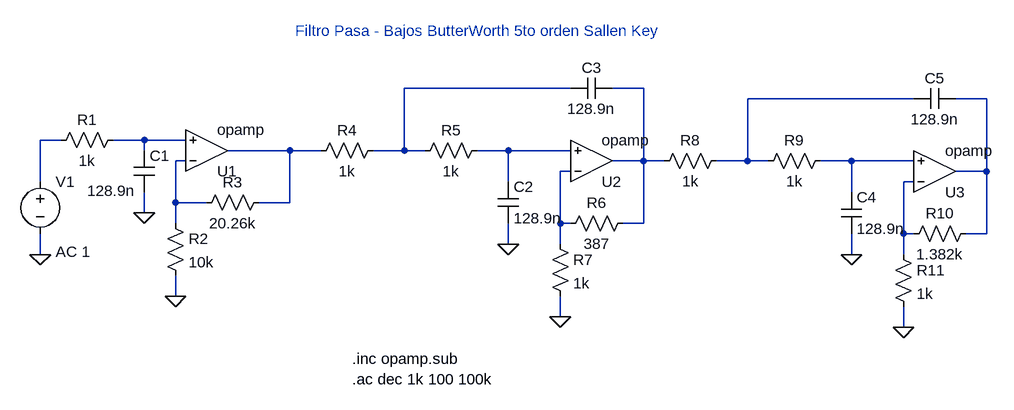
[diagram p0: schematic EJE2.asc]
EJE2.asc, the LTspice schematic file:
Version 4
SHEET 1 1384 680
WIRE 736 16 480 16
WIRE 848 16 800 16
WIRE 1264 32 1008 32
WIRE 1376 32 1328 32
WIRE -48 96 -80 96
WIRE 80 96 32 96
WIRE 144 96 80 96
WIRE 80 112 80 96
WIRE 304 112 208 112
WIRE 352 112 304 112
WIRE 480 112 480 16
WIRE 480 112 432 112
WIRE 512 112 480 112
WIRE 640 112 592 112
WIRE 736 112 640 112
WIRE 144 128 128 128
WIRE 848 128 848 16
WIRE 848 128 800 128
WIRE 880 128 848 128
WIRE 1008 128 1008 32
WIRE 1008 128 960 128
WIRE 1040 128 1008 128
WIRE 1168 128 1120 128
WIRE 1264 128 1168 128
WIRE 736 144 720 144
WIRE 1376 144 1376 32
WIRE 1376 144 1328 144
WIRE -80 160 -80 96
WIRE 640 160 640 112
WIRE 1264 160 1248 160
WIRE 1168 176 1168 128
WIRE 128 192 128 128
WIRE 176 192 128 192
WIRE 304 192 304 112
WIRE 304 192 256 192
WIRE 80 208 80 176
WIRE 128 224 128 192
WIRE 720 224 720 144
WIRE 736 224 720 224
WIRE 848 224 848 128
WIRE 848 224 816 224
WIRE 1248 240 1248 160
WIRE 1264 240 1248 240
WIRE 1376 240 1376 144
WIRE 1376 240 1344 240
WIRE 640 256 640 224
WIRE 720 256 720 224
WIRE -80 272 -80 240
WIRE 1168 272 1168 240
WIRE 1248 272 1248 240
WIRE 128 336 128 304
WIRE 720 368 720 336
WIRE 1248 384 1248 352
FLAG 128 336 0
FLAG 80 208 0
FLAG 640 256 0
FLAG 720 368 0
FLAG 1168 272 0
FLAG 1248 384 0
FLAG -80 272 0
SYMBOL res 48 80 R90
WINDOW 0 0 56 VBottom 2
WINDOW 3 32 56 VTop 2
SYMATTR InstName R1
SYMATTR Value 1k
SYMBOL cap 64 112 R0
WINDOW 3 -72 62 Left 2
SYMATTR Value 128.9n
SYMATTR InstName C1
SYMBOL OpAmps\\opamp 176 176 M180
SYMATTR InstName U1
SYMBOL res 112 208 R0
SYMATTR InstName R2
SYMATTR Value 10k
SYMBOL res 272 176 R90
WINDOW 0 0 56 VBottom 2
WINDOW 3 32 56 VTop 2
SYMATTR InstName R3
SYMATTR Value 20.26k
SYMBOL res 448 96 R90
WINDOW 0 0 56 VBottom 2
WINDOW 3 32 56 VTop 2
SYMATTR InstName R4
SYMATTR Value 1k
SYMBOL res 608 96 R90
WINDOW 0 0 56 VBottom 2
WINDOW 3 32 56 VTop 2
SYMATTR InstName R5
SYMATTR Value 1k
SYMBOL cap 624 160 R0
SYMATTR InstName C2
SYMATTR Value 128.9n
SYMBOL OpAmps\\opamp 768 192 M180
SYMATTR InstName U2
SYMBOL res 832 208 R90
WINDOW 0 0 56 VBottom 2
WINDOW 3 32 56 VTop 2
SYMATTR InstName R6
SYMATTR Value 387
SYMBOL res 704 240 R0
SYMATTR InstName R7
SYMATTR Value 1k
SYMBOL cap 800 0 R90
WINDOW 0 0 32 VBottom 2
WINDOW 3 32 32 VTop 2
SYMATTR InstName C3
SYMATTR Value 128.9n
SYMBOL res 976 112 R90
WINDOW 0 0 56 VBottom 2
WINDOW 3 32 56 VTop 2
SYMATTR InstName R8
SYMATTR Value 1k
SYMBOL res 1136 112 R90
WINDOW 0 0 56 VBottom 2
WINDOW 3 32 56 VTop 2
SYMATTR InstName R9
SYMATTR Value 1k
SYMBOL cap 1152 176 R0
SYMATTR InstName C4
SYMATTR Value 128.9n
SYMBOL OpAmps\\opamp 1296 208 M180
SYMATTR InstName U3
SYMBOL res 1360 224 R90
WINDOW 0 0 56 VBottom 2
WINDOW 3 32 56 VTop 2
SYMATTR InstName R10
SYMATTR Value 1.382k
SYMBOL res 1232 256 R0
SYMATTR InstName R11
SYMATTR Value 1k
SYMBOL cap 1328 16 R90
WINDOW 0 0 32 VBottom 2
WINDOW 3 32 32 VTop 2
SYMATTR InstName C5
SYMATTR Value 128.9n
SYMBOL voltage -80 144 R0
WINDOW 123 24 124 Left 2
WINDOW 39 0 0 Left 0
SYMATTR Value2 AC 1
SYMATTR InstName V1
SYMATTR Value ""
TEXT 400 464 Left 2 !.ac dec 1k 100 100k
TEXT 400 432 Left 2 !.inc opamp.sub
TEXT 312 -72 Left 2 ;Filtro Pasa - Bajos ButterWorth 5to orden Sallen Key

The netlist it stands for:
* EJE2.asc
R1 N006 N005 1k
C1 N006 0 128.9n
XU1 N009 N006 N007 opamp Aol=100K GBW=10Meg  ; pins invin noninvin out
R2 N009 0 10k
R3 N007 N009 20.26k
R4 N001 N007 1k
R5 N008 N001 1k
C2 N008 0 128.9n
XU2 N011 N008 N002 opamp Aol=100K GBW=10Meg  ; pins invin noninvin out
R6 N002 N011 387
R7 N011 0 1k
C3 N002 N001 128.9n
R8 N003 N002 1k
R9 N010 N003 1k
C4 N010 0 128.9n
XU3 N012 N010 N004 opamp Aol=100K GBW=10Meg  ; pins invin noninvin out
R10 N004 N012 1.382k
R11 N012 0 1k
C5 N004 N003 128.9n
V1 N005 0 AC 1
.ac dec 1k 100 100k
.inc opamp.sub
* Filtro Pasa - Bajos ButterWorth 5to orden Sallen Key
.backanno
.end